# EAGLE design Hanse081210bestellung (EAGLE 5.10)
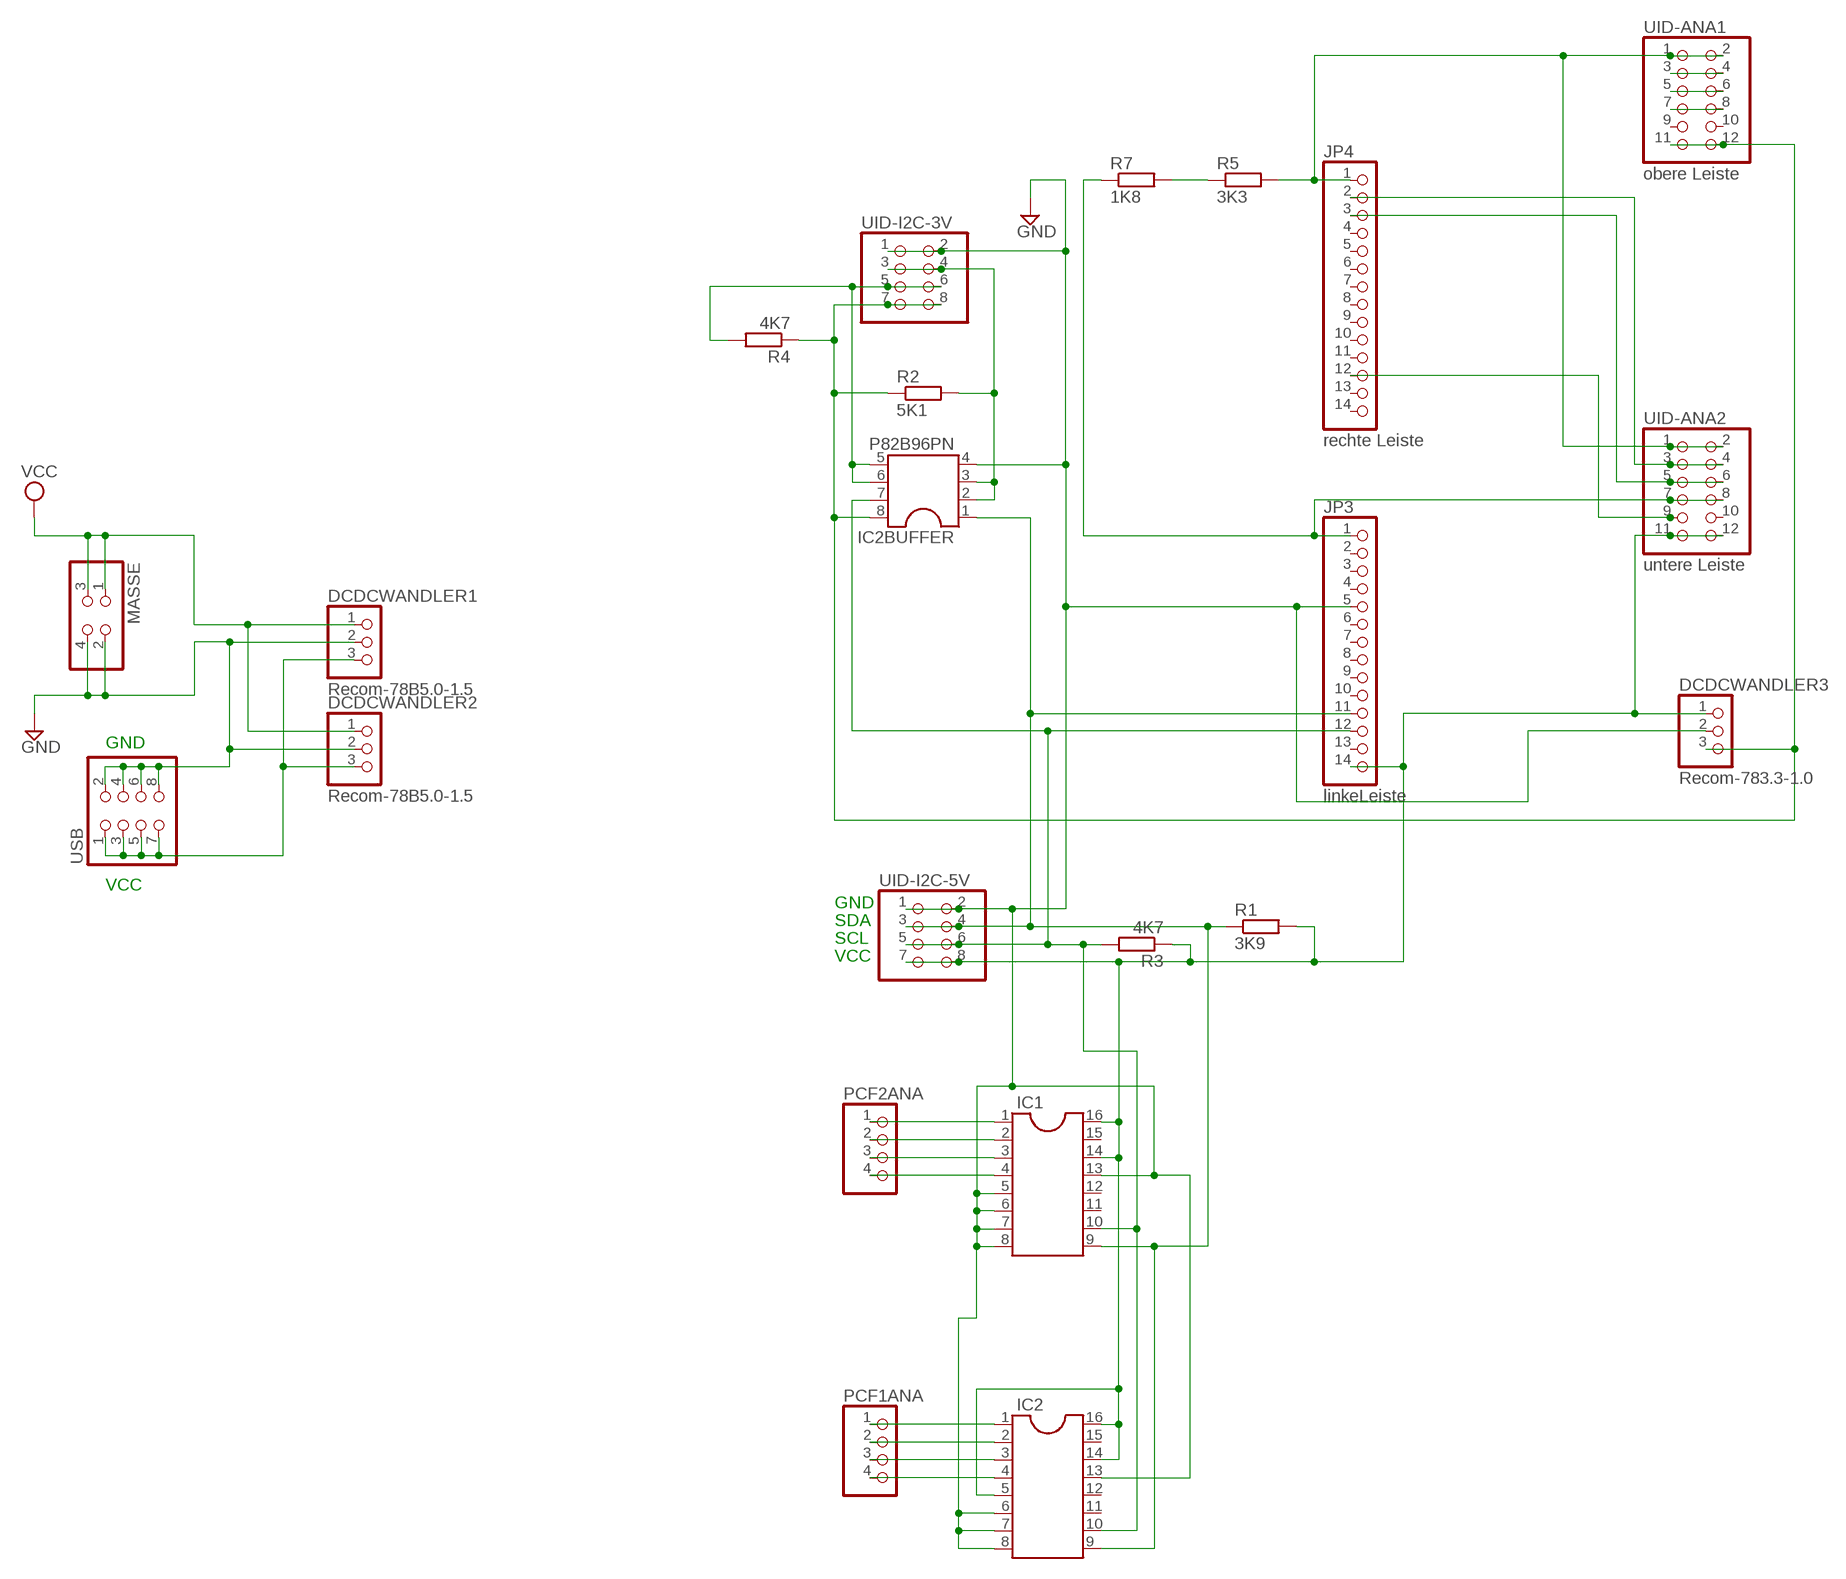
[diagram p0: schematic, sheet 1]

## Parts
DCDCWANDLER1  Recom-78B5.0-1.5  PINHD-1X3  [1X03]
DCDCWANDLER2  Recom-78B5.0-1.5  PINHD-1X3  [1X03]
DCDCWANDLER3  Recom-783.3-1.0  PINHD-1X3  [1X03]
IC1  DIL16S  [SOCKET-16]
IC2  DIL16S  [SOCKET-16]
IC2BUFFER  P82B96PN  DIL8S  [SOCKET-08]
JP3  linkeLeiste  PINHD-1X14  [1X14]
JP4  rechte Leiste  PINHD-1X14  [1X14]
MASSE  PINHD-2X2  [2X02]
PCF1ANA  PINHD-1X4  [1X04]
PCF2ANA  PINHD-1X4  [1X04]
R1  3K9  R-EU_R0805  [R0805]
R2  5K1  R-EU_R0805  [R0805]
R3  4K7  R-EU_R0805  [R0805]
R4  4K7  R-EU_R0805  [R0805]
R5  3K3  R-EU_R0805  [R0805]
R7  1K8  R-EU_R0805  [R0805]
UID-ANA1  obere Leiste  PINHD-2X6  [2X06]
UID-ANA2  untere Leiste  PINHD-2X6  [2X06]
UID-I2C-3V  PINHD-2X4  [2X04]
UID-I2C-5V  PINHD-2X4  [2X04]
USB  PINHD-2X4  [2X04]

## Nets
GND: DCDCWANDLER1.2 DCDCWANDLER2.2 DCDCWANDLER3.2 IC1.5 IC1.6 IC1.7 IC1.8 IC1.13 IC2.6 IC2.7 IC2.8 IC2.13 IC2BUFFER.4 JP3.5 MASSE.2 MASSE.4 UID-I2C-3V.1 UID-I2C-3V.2 UID-I2C-5V.1 UID-I2C-5V.2 USB.2 USB.4 USB.6 USB.8
N$5: IC2BUFFER.5 IC2BUFFER.6 R4.2 UID-I2C-3V.5 UID-I2C-3V.6
N$6: JP4.2 UID-ANA2.3 UID-ANA2.4
N$7: DCDCWANDLER1.3 DCDCWANDLER2.3 USB.1 USB.3 USB.5 USB.7
N$8: JP4.3 UID-ANA2.5 UID-ANA2.6
N$9: IC2BUFFER.2 IC2BUFFER.3 R2.2 UID-I2C-3V.3 UID-I2C-3V.4
N$10: DCDCWANDLER3.1 IC1.14 IC1.16 IC2.5 IC2.14 IC2.16 JP3.14 R1.2 R3.1 UID-ANA2.11 UID-ANA2.12 UID-I2C-5V.7 UID-I2C-5V.8
N$12: UID-ANA1.3 UID-ANA1.4
N$13: UID-ANA1.5 UID-ANA1.6
N$14: UID-ANA1.7 UID-ANA1.8
N$15: DCDCWANDLER3.3 IC2BUFFER.8 R2.1 R4.1 UID-ANA1.11 UID-ANA1.12 UID-I2C-3V.7 UID-I2C-3V.8
N$16: JP4.12 UID-ANA2.9
N$17: JP4.1 R5.2 UID-ANA1.1 UID-ANA1.2 UID-ANA2.1 UID-ANA2.2
N$18: IC1.9 IC2.9 IC2BUFFER.1 JP3.11 R1.1 UID-I2C-5V.3 UID-I2C-5V.4
N$19: R5.1 R7.2
N$21: JP3.1 R7.1 UID-ANA2.7 UID-ANA2.8
N$23: IC1.10 IC2.10 IC2BUFFER.7 JP3.12 R3.2 UID-I2C-5V.5 UID-I2C-5V.6
N$30: IC1.1 PCF2ANA.1
N$31: IC1.2 PCF2ANA.2
N$32: IC1.3 PCF2ANA.3
N$33: IC1.4 PCF2ANA.4
N$34: IC2.1 PCF1ANA.1
N$35: IC2.2 PCF1ANA.2
N$36: IC2.3 PCF1ANA.3
N$37: IC2.4 PCF1ANA.4
VCC: DCDCWANDLER1.1 DCDCWANDLER2.1 MASSE.1 MASSE.3
Unconnected: IC1.11 IC1.12 IC1.15 IC2.11 IC2.12 IC2.15 JP3.2 JP3.3 JP3.4 JP3.6 JP3.7 JP3.8 JP3.9 JP3.10 JP3.13 JP4.4 JP4.5 JP4.6 JP4.7 JP4.8 JP4.9 JP4.10 JP4.11 JP4.13 JP4.14 UID-ANA1.9 UID-ANA1.10 UID-ANA2.10

## Notes on the sheet
- GND
- VCC
- GND
- SDA
- SCL
- VCC

## Library data of the parts
DCDCWANDLER1-DCDCWANDLER3 = pinhead:PINHD-1X3: PIN HEADER
IC1 IC2 = ic-package:DIL16: Dual In Line / Socket
IC2BUFFER = ic-package:DIL8: Dual In Line / Socket
JP3 JP4 = pinhead:PINHD-1X14: PIN HEADER
MASSE = pinhead:PINHD-2X2: PIN HEADER
PCF1ANA PCF2ANA = pinhead:PINHD-1X4: PIN HEADER
R1-R5 R7 = rcl:R-EU_: RESISTOR, European symbol
UID-ANA1 UID-ANA2 = pinhead:PINHD-2X6: PIN HEADER
UID-I2C-3V UID-I2C-5V USB = pinhead:PINHD-2X4: PIN HEADER

## Board
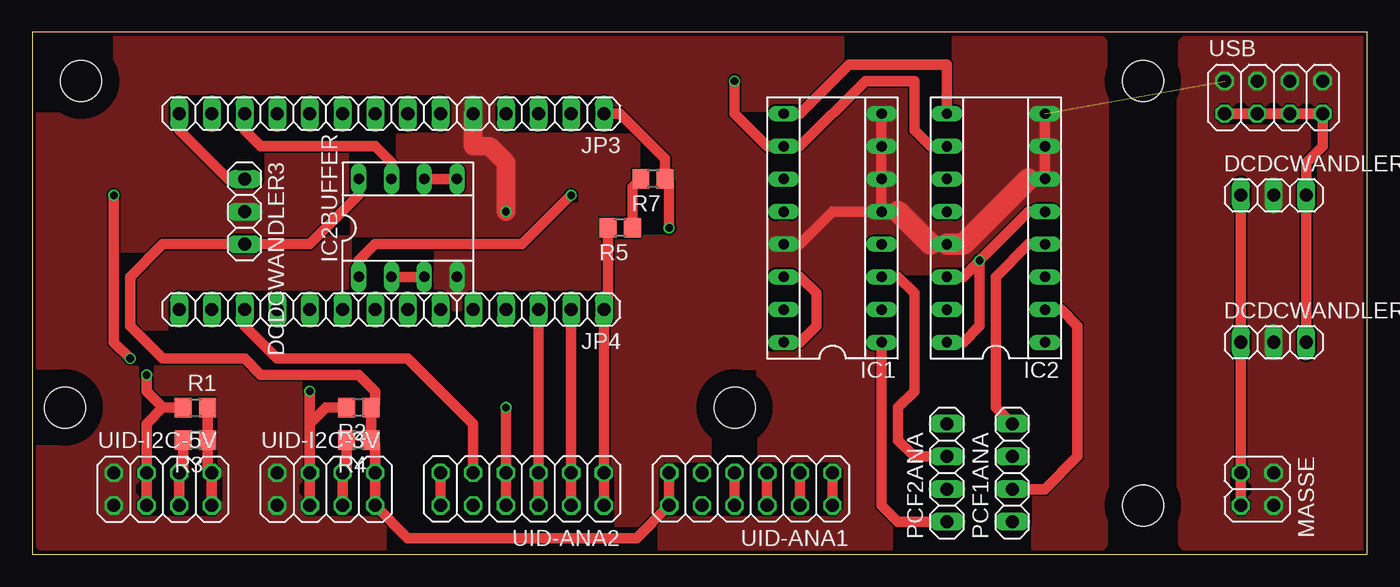
[diagram p1: board, top side]
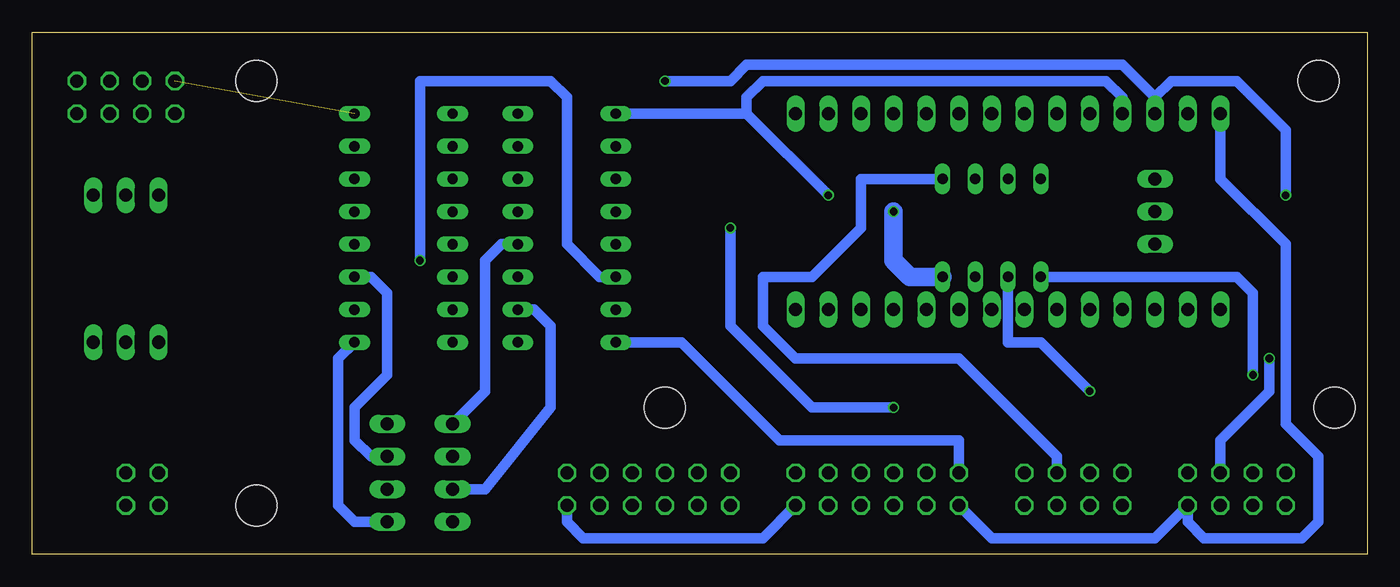
[diagram p2: board, bottom side, seen from below]

Size 103.81 x 40.63 mm. Coordinates in mm from the lower left corner, seen from the top.
Outline: 0,0 103.81,0 103.81,40.63 0,40.63 0,0
Copper layers (1*16): Top 0.035mm / dielectric 1.5mm / Bottom 0.035mm
Design rules "PCB-POOL HighSpec": minimum track width 0.125mm, minimum drill 0.2mm, track to track 0.125mm, track to pad 0.125mm, pad to pad 0.125mm, via to via 0.125mm, smd to smd 0.125mm, copper to edge 0.3mm, drill to drill 0.2mm, minimum pad ring 0.2mm, minimum via ring 0.125mm, stop-mask expansion 0.075mm, vias tented up to drill 0mil, thermal gap 0.2mm
Holes 3.2 mm at 3.81,36.83 86.36,36.83 86.36,3.81 54.61,11.43 2.54,11.43
tRestrict: area 0,8.9 to 5.1,14; area 1.3,34.3 to 6.3,39.4; area 52.1,8.9 to 57.1,14; area 83.8,1.3 to 88.9,6.3; area 83.8,34.3 to 88.9,39.4

### Footprints (pad centres in the part's own frame; a part is rotated, then mirrored left to right if it is on the bottom)
1X03 = drill 1.016 long: 1 -2.54,0; 2 0,0; 3 2.54,0
SOCKET-16 = drill 0.813 long: 1 -8.89,-3.81; 2 -6.35,-3.81; 3 -3.81,-3.81; 4 -1.27,-3.81; 5 1.27,-3.81; 6 3.81,-3.81; 7 6.35,-3.81; 8 8.89,-3.81; 9 8.89,3.81; 10 6.35,3.81; 11 3.81,3.81; 12 1.27,3.81; 13 -1.27,3.81; 14 -3.81,3.81; 15 -6.35,3.81; 16 -8.89,3.81
SOCKET-08 = drill 0.813 long: 1 -3.81,-3.81; 2 -1.27,-3.81; 3 1.27,-3.81; 4 3.81,-3.81; 5 3.81,3.81; 6 1.27,3.81; 7 -1.27,3.81; 8 -3.81,3.81
1X14 = drill 1.016 long: 1 -16.51,0; 2 -13.97,0; 3 -11.43,0; 4 -8.89,0; 5 -6.35,0; 6 -3.81,0; 7 -1.27,0; 8 1.27,0; 9 3.81,0; 10 6.35,0; 11 8.89,0; 12 11.43,0; 13 13.97,0; 14 16.51,0
2X02 = drill 1.016 octagon: 1 -1.27,-1.27; 2 -1.27,1.27; 3 1.27,-1.27; 4 1.27,1.27
1X04 = drill 1.016 long: 1 -3.81,0; 2 -1.27,0; 3 1.27,0; 4 3.81,0
R0805 = smd 1.3 x 1.5: 1 -0.95,0; 2 0.95,0
2X06 = drill 1.016 octagon: 1 -6.35,-1.27; 2 -6.35,1.27; 3 -3.81,-1.27; 4 -3.81,1.27; 5 -1.27,-1.27; 6 -1.27,1.27; 7 1.27,-1.27; 8 1.27,1.27; 9 3.81,-1.27; 10 3.81,1.27; 11 6.35,-1.27; 12 6.35,1.27
2X04 = drill 1.016 octagon: 1 -3.81,-1.27; 2 -3.81,1.27; 3 -1.27,-1.27; 4 -1.27,1.27; 5 1.27,-1.27; 6 1.27,1.27; 7 3.81,-1.27; 8 3.81,1.27

### Placement (x,y rotation side)
DCDCWANDLER1  96.52,27.94 0 top
DCDCWANDLER2  96.52,16.51 0 top
DCDCWANDLER3  16.51,26.67 270 top
IC1  62.23,25.4 90 top
IC2  74.93,25.4 90 top
IC2BUFFER  29.21,25.4 0 top
JP3  27.94,34.29 180 top
JP4  27.94,19.05 180 top
MASSE  95.25,5.08 270 top
PCF1ANA  76.2,6.35 90 top
PCF2ANA  71.12,6.35 90 top
R1  12.7,11.43 0 top
R2  25.4,11.43 180 top
R3  12.7,8.89 180 top
R4  25.4,8.89 180 top
R5  45.72,25.4 180 top
R7  48.26,29.21 180 top
UID-ANA1  55.88,5.08 180 top
UID-ANA2  38.1,5.08 180 top
UID-I2C-3V  22.86,5.08 0 top
UID-I2C-5V  10.16,5.08 0 top
USB  96.52,35.56 0 top

### Tracks (layer width: path | path; a pad name or v marks a point on that pad's centre or on a via)
GND  (via drill 0.6 pad 0.41)  (1 unrouted)
  Top 0.813: IC2.8 IC2.7 IC2.6 77.47,29.21 | 69.85,24.13 IC2.13 | IC1.5 67.31,26.67 | IC1.5 62.23,26.67 59.69,24.13 IC1.13 | IC1.5 IC1.6 IC1.7 IC1.8
  Top 1.422: v36.83,26.67 36.83,30.48 35.56,31.75 34.29,31.75 JP3.5
  Top 1.676: 77.47,29.21 72.39,24.13 IC2.13 | 67.31,26.67 69.85,24.13
  Bottom 1.422: IC2BUFFER.4 35.56,21.59 36.83,22.86 v36.83,26.67
  pour Top: 1.27,39.37 1.27,1.27 82.55,1.27 82.55,39.37
  pour Top: 90.17,39.37 90.17,1.27 102.87,1.27 102.87,39.37
N$5
  Top 0.813: UID-I2C-3V.5 UID-I2C-3V.6 24.45,6.67 R4.2 | IC2BUFFER.5 IC2BUFFER.6
  Bottom 0.813: UID-I2C-3V.6 24.13,7.62 31.75,15.24 44.45,15.24 46.99,17.78 46.99,21.59 43.18,21.59 39.37,25.4 39.37,29.21 IC2BUFFER.5
N$6
  Top 0.813: UID-ANA2.4 UID-ANA2.3 JP4.2
N$7
  Top 0.813: USB.1 USB.3 USB.5 USB.7 100.33,31.75 99.06,30.48 DCDCWANDLER1.3 DCDCWANDLER2.3
N$8
  Top 0.813: UID-ANA2.6 UID-ANA2.5 JP4.3
N$9  (via drill 0.6 pad 0.41)
  Top 0.813: UID-I2C-3V.3 UID-I2C-3V.4 21.59,10.16 | R2.2 22.86,11.43 21.59,10.16 | IC2BUFFER.2 IC2BUFFER.3 | 21.59,10.16 v21.59,12.7
  Bottom 0.813: IC2BUFFER.2 27.94,16.51 25.4,16.51 v21.59,12.7
N$10  (via drill 0.6)
  Top 0.813: UID-I2C-5V.7 UID-I2C-5V.8 13.65,6.67 R3.1 R1.2 | UID-ANA2.12 UID-ANA2.11 | IC2.5 77.47,26.67 v73.66,22.86 | v73.66,22.86 72.39,21.59 IC2.14 | IC2.16 72.39,16.51 73.66,17.78 v73.66,22.86 | IC1.14 59.69,21.59 60.96,20.32 60.96,17.78 59.69,16.51 IC1.16 | JP3.14 11.43,33.02 15.24,29.21 DCDCWANDLER3.1
  Bottom 0.813: UID-ANA2.12 29.21,1.27 16.51,1.27 UID-I2C-5V.7 13.97,2.54 12.7,1.27 5.08,1.27 3.81,2.54 3.81,7.62 6.35,10.16 6.35,24.13 11.43,29.21 JP3.14 | v73.66,22.86 73.66,36.83 63.5,36.83 62.23,35.56 62.23,24.13 59.69,21.59 IC1.14 | UID-ANA2.11 31.75,8.89 45.72,8.89 53.34,16.51 IC1.16
N$12
  Top 0.813: UID-ANA1.4 UID-ANA1.3
N$13
  Top 0.813: UID-ANA1.6 UID-ANA1.5
N$14
  Top 0.813: UID-ANA1.8 UID-ANA1.7
N$15
  Top 0.813: UID-ANA1.11 UID-ANA1.12 46.99,1.27 29.21,1.27 UID-I2C-3V.7 UID-I2C-3V.8 26.67,8.57 R4.1 R2.1 26.67,11.75 26.67,12.7 25.4,13.97 17.78,13.97 16.51,15.24 10.16,15.24 7.62,17.78 7.62,21.59 10.16,24.13 DCDCWANDLER3.3 21.59,24.13 25.4,27.94 IC2BUFFER.8
N$16
  Top 0.813: UID-ANA2.9 34.29,10.16 29.21,15.24 19.05,15.24 16.51,17.78 JP4.12
N$17
  Top 0.813: UID-ANA1.2 UID-ANA1.1 | UID-ANA2.2 UID-ANA2.1 JP4.1 44.77,19.37 R5.2
  Bottom 0.813: UID-ANA2.2 46.99,1.27 60.96,1.27 62.23,2.54 UID-ANA1.2
N$18  (via drill 0.6 pad 0.41)
  Top 0.813: UID-I2C-5V.3 UID-I2C-5V.4 8.89,10.16 10.16,11.43 | 10.16,11.43 R1.1 | IC2.9 71.12,38.1 63.5,38.1 59.69,34.29 IC1.9 | IC2BUFFER.1 25.4,22.86 26.67,24.13 38.1,24.13 v41.91,27.94 | v8.89,13.97 8.89,12.7 10.16,11.43
  Bottom 0.813: 48.26,34.29 IC1.9 | v41.91,27.94 48.26,34.29 | 48.26,34.29 48.26,35.56 46.99,36.83 20.32,36.83 19.05,35.56 JP3.11 | IC2BUFFER.1 10.16,21.59 8.89,20.32 v8.89,13.97
N$19
  Top 0.813: R5.1 46.67,28.57 R7.2
N$21  (via drill 0.6 pad 0.41)
  Top 0.813: UID-ANA2.8 UID-ANA2.7 v36.83,11.43 | JP3.1 45.72,34.29 49.21,30.8 R7.1 49.53,28.89 v49.53,25.4
  Bottom 0.813: v49.53,25.4 49.53,17.78 43.18,11.43 v36.83,11.43
N$23  (via drill 0.6 pad 0.41)
  Top 0.813: UID-I2C-5V.5 UID-I2C-5V.6 11.75,6.67 R3.2 | IC2.10 69.85,31.75 68.58,33.02 68.58,36.83 64.77,36.83 59.69,31.75 IC1.10 57.15,31.75 54.61,34.29 v54.61,36.83 | v7.62,15.24 6.35,16.51 v6.35,27.94 | IC2BUFFER.7 27.94,30.48 26.67,31.75 17.78,31.75 16.51,33.02 JP3.12
  Bottom 0.813: v6.35,27.94 6.35,33.02 10.16,36.83 15.24,36.83 16.51,35.56 | 16.51,35.56 JP3.12 | v54.61,36.83 49.53,36.83 48.26,38.1 19.05,38.1 16.51,35.56 | v7.62,15.24 7.62,12.7 11.43,8.89 UID-I2C-5V.6
N$30
  Top 0.813: IC1.1 66.04,3.81 67.31,2.54 PCF2ANA.1
N$31
  Bottom 0.813: IC1.2 64.77,19.05 63.5,17.78 63.5,11.43 68.58,5.08 PCF2ANA.2
N$32
  Top 0.813: IC1.3 67.31,21.59 68.58,20.32 68.58,12.7 67.31,11.43 67.31,8.89 68.58,7.62 PCF2ANA.3
N$33
  Bottom 0.813: IC1.4 67.31,24.13 68.58,22.86 68.58,12.7 PCF2ANA.4
N$34
  Bottom 0.813: IC2.1 80.01,15.24 80.01,3.81 78.74,2.54 PCF1ANA.1
N$35
  Top 0.813: IC2.2 80.01,19.05 81.28,17.78 81.28,7.62 78.74,5.08 PCF1ANA.2
N$36
  Bottom 0.813: IC2.3 77.47,21.59 76.2,20.32 76.2,13.97 78.74,11.43 78.74,8.89 77.47,7.62 PCF1ANA.3
N$37
  Top 0.813: IC2.4 77.47,24.13 74.93,21.59 74.93,11.43 PCF1ANA.4
VCC
  Top 0.813: MASSE.3 MASSE.1 DCDCWANDLER2.1 DCDCWANDLER1.1